# EAGLE design PGTN021_teensy (EAGLE 9.5.0)
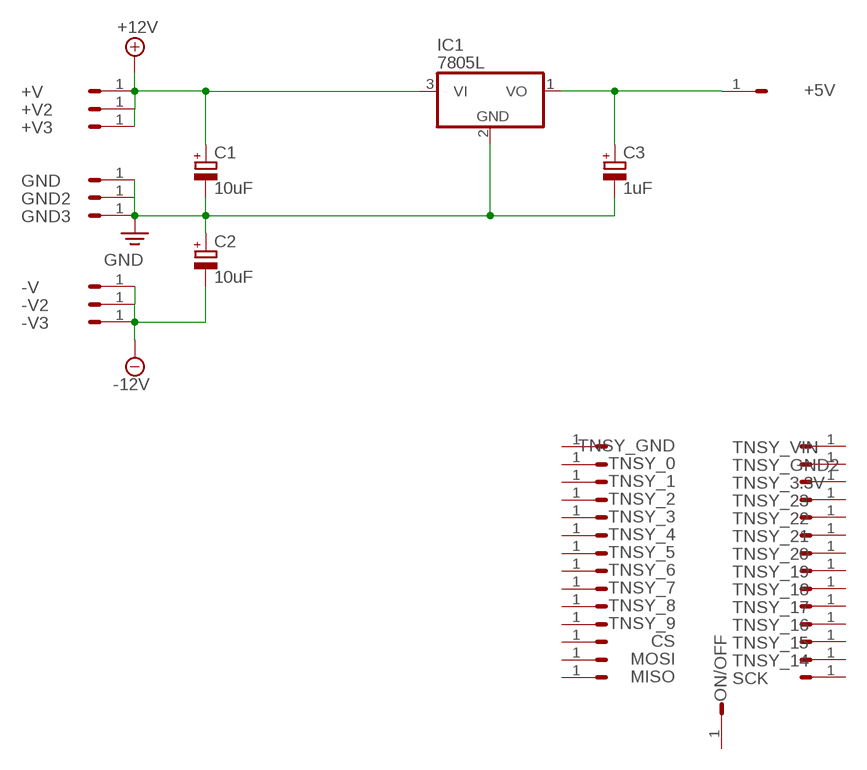
[diagram p0: schematic, sheet 1]

## Parts
+5V  HEADER/MALE/01  [HEADER/MALE/01]
+V  HEADER/MALE/01  [HEADER/MALE/01]
+V2  HEADER/MALE/01  [HEADER/MALE/01]
+V3  HEADER/MALE/01  [HEADER/MALE/01]
-V  HEADER/MALE/01  [HEADER/MALE/01]
-V2  HEADER/MALE/01  [HEADER/MALE/01]
-V3  HEADER/MALE/01  [HEADER/MALE/01]
C1  10uF  CAPACITOR/POLARIZEDE2.5-6  [E2,5-6]
C2  10uF  CAPACITOR/POLARIZEDE2.5-6  [E2,5-6]
C3  1uF  CAPACITOR/POLARIZEDE2.5-6  [E2,5-6]
CS  HEADER/MALE/01  [HEADER/MALE/01]
GND  HEADER/MALE/01  [HEADER/MALE/01]
GND2  HEADER/MALE/01  [HEADER/MALE/01]
GND3  HEADER/MALE/01  [HEADER/MALE/01]
IC1  7805L  [TO92]
MISO  HEADER/MALE/01  [HEADER/MALE/01]
MOSI  HEADER/MALE/01  [HEADER/MALE/01]
ON/OFF  HEADER/MALE/01  [HEADER/MALE/01]
SCK  HEADER/MALE/01  [HEADER/MALE/01]
TNSY_0  HEADER/MALE/01  [HEADER/MALE/01]
TNSY_1  HEADER/MALE/01  [HEADER/MALE/01]
TNSY_2  HEADER/MALE/01  [HEADER/MALE/01]
TNSY_3  HEADER/MALE/01  [HEADER/MALE/01]
TNSY_3.3V  HEADER/MALE/01  [HEADER/MALE/01]
TNSY_4  HEADER/MALE/01  [HEADER/MALE/01]
TNSY_5  HEADER/MALE/01  [HEADER/MALE/01]
TNSY_6  HEADER/MALE/01  [HEADER/MALE/01]
TNSY_7  HEADER/MALE/01  [HEADER/MALE/01]
TNSY_8  HEADER/MALE/01  [HEADER/MALE/01]
TNSY_9  HEADER/MALE/01  [HEADER/MALE/01]
TNSY_14  HEADER/MALE/01  [HEADER/MALE/01]
TNSY_15  HEADER/MALE/01  [HEADER/MALE/01]
TNSY_16  HEADER/MALE/01  [HEADER/MALE/01]
TNSY_17  HEADER/MALE/01  [HEADER/MALE/01]
TNSY_18  HEADER/MALE/01  [HEADER/MALE/01]
TNSY_19  HEADER/MALE/01  [HEADER/MALE/01]
TNSY_20  HEADER/MALE/01  [HEADER/MALE/01]
TNSY_21  HEADER/MALE/01  [HEADER/MALE/01]
TNSY_22  HEADER/MALE/01  [HEADER/MALE/01]
TNSY_23  HEADER/MALE/01  [HEADER/MALE/01]
TNSY_GND  HEADER/MALE/01  [HEADER/MALE/01]
TNSY_GND2  HEADER/MALE/01  [HEADER/MALE/01]
TNSY_VIN  HEADER/MALE/01  [HEADER/MALE/01]

## Nets
+12V: +V2.1 +V3.1 +V.1 C1.+ IC1.3(VI)
-12V: -V2.1 -V3.1 -V.1 C2.-
GND: C1.- C2.+ C3.- GND2.1 GND3.1 GND.1 IC1.2(GND)
N$1: +5V.1 C3.+ IC1.1(VO)
Unconnected: CS.1 MISO.1 MOSI.1 ON/OFF.1 SCK.1 TNSY_0.1 TNSY_1.1 TNSY_2.1 TNSY_3.1 TNSY_3.3V.1 TNSY_4.1 TNSY_5.1 TNSY_6.1 TNSY_7.1 TNSY_8.1 TNSY_9.1 TNSY_14.1 TNSY_15.1 TNSY_16.1 TNSY_17.1 TNSY_18.1 TNSY_19.1 TNSY_20.1 TNSY_21.1 TNSY_22.1 TNSY_23.1 TNSY_GND2.1 TNSY_GND.1 TNSY_VIN.1

## Library data of the parts
+5V +V +V2 +V3 -V -V2 -V3 CS GND GND2 GND3 MISO MOSI ON/OFF SCK TNSY_0 TNSY_1-TNSY_3 TNSY_3.3V TNSY_4-TNSY_9 TNSY_14-TNSY_23 TNSY_GND TNSY_GND2 TNSY_VIN = connectors:HEADER/MALE/01; SPICEPREFIX: X
C1-C3 = capacitors:CAPACITOR/POLARIZED: POLARIZED CAPACITOR, European symbol; SPICEPREFIX: C
IC1 = ic_voltage_reg:78*: Positive VOLTAGE REGULATOR Source: http://cache.national.com/ds/LM/LM78L05.pdf http://www.fairchildsemi.com/ds/LM/LM7805.pdf

## Board
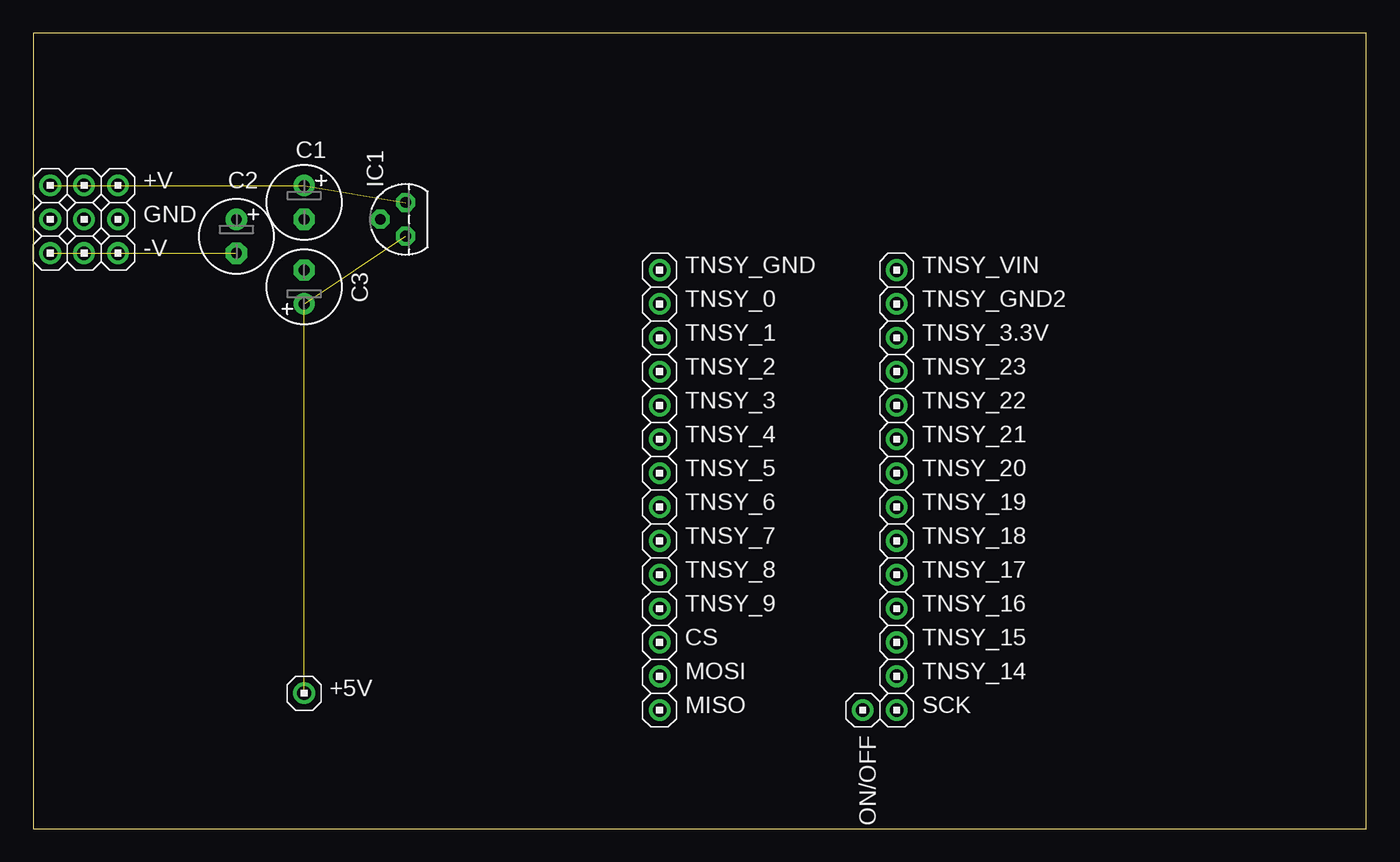
[diagram p1: board, top side]
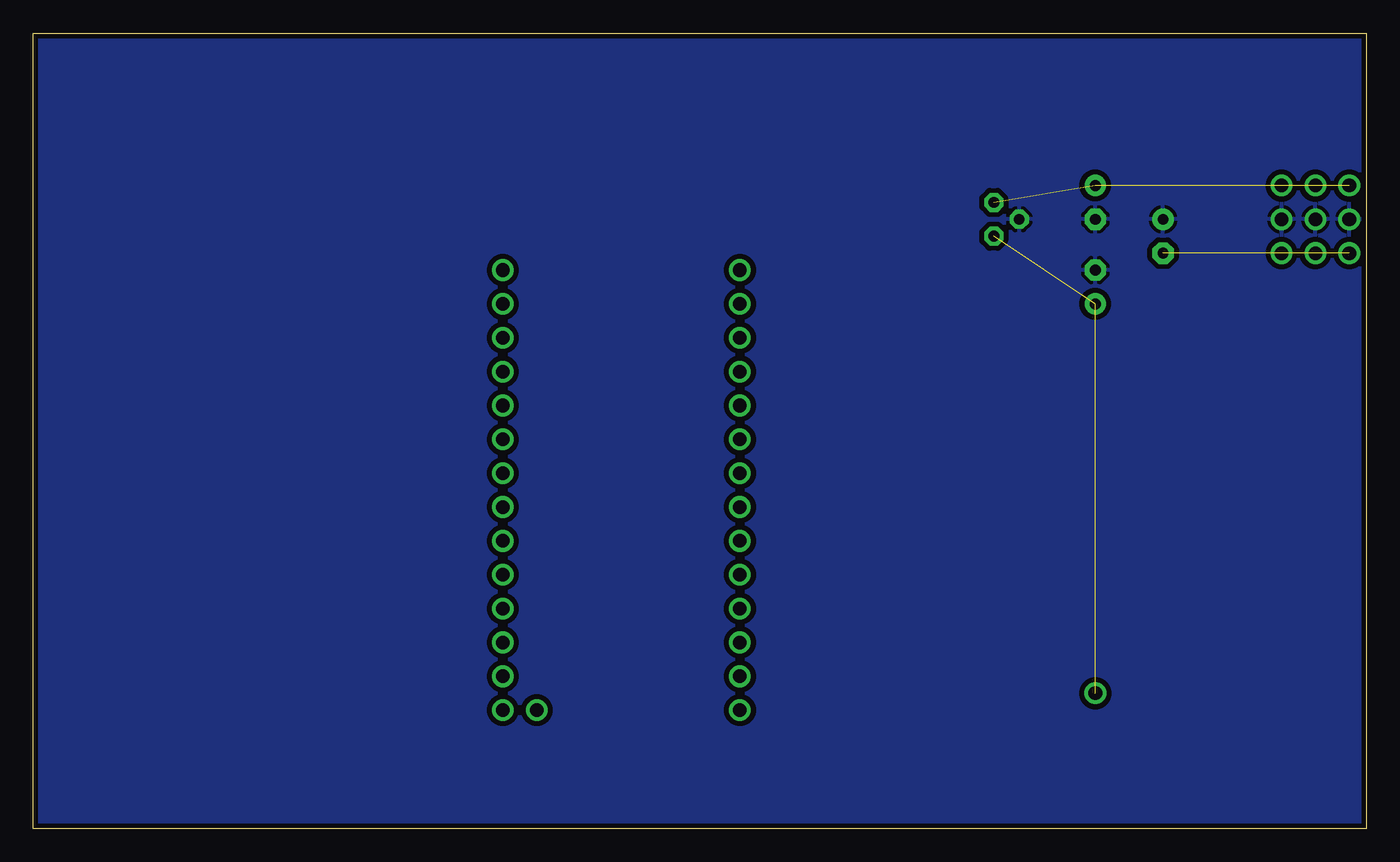
[diagram p2: board, bottom side, seen from below]

Size 100 x 59.68 mm. Coordinates in mm from the lower left corner, seen from the top.
Outline: 0,0 100,0 100,59.68 0,59.68 0,0
Copper layers (1*16): Top 0.0356mm / dielectric 1.5011mm / Bottom 0.0356mm
Design rules "pigatron": minimum track width 12mil, minimum drill 13mil, track to track 15mil, track to pad 10mil, pad to pad 10mil, via to via 10mil, smd to smd 6mil, copper to edge 15mil, drill to drill 10mil, minimum pad ring 12mil, minimum via ring 10mil, stop-mask expansion 4mil, vias tented up to drill 0mil, thermal gap 10mil

### Footprints (pad centres in the part's own frame; a part is rotated, then mirrored left to right if it is on the bottom)
HEADER/MALE/01 = drill 1.016: 1 0,0
E2,5-6 = drill 0.813 pad 1.6: + -1.27,0 | drill 0.813 pad 1.6 octagon: - 1.27,0
TO92 = drill 0.813 octagon: 1 -1.27,0; 2 0,1.905; 3 1.27,0

### Placement (x,y rotation side)
+5V  20.32,10.16 0 top
+V  6.35,48.26 0 top
+V2  3.81,48.26 0 top
+V3  1.27,48.26 0 top
-V  6.35,43.18 0 top
-V2  3.81,43.18 0 top
-V3  1.27,43.18 0 top
C1  20.32,46.99 270 top
C2  15.24,44.45 270 top
C3  20.32,40.64 90 top
CS  46.99,13.97 0 top
GND  6.35,45.72 0 top
GND2  1.27,45.72 0 top
GND3  3.81,45.72 0 top
IC1  27.94,45.72 90 top
MISO  46.99,8.89 0 top
MOSI  46.99,11.43 0 top
ON/OFF  62.23,8.89 270 top
SCK  64.77,8.89 0 top
TNSY_0  46.99,39.37 0 top
TNSY_1  46.99,36.83 0 top
TNSY_2  46.99,34.29 0 top
TNSY_3  46.99,31.75 0 top
TNSY_3.3V  64.77,36.83 0 top
TNSY_4  46.99,29.21 0 top
TNSY_5  46.99,26.67 0 top
TNSY_6  46.99,24.13 0 top
TNSY_7  46.99,21.59 0 top
TNSY_8  46.99,19.05 0 top
TNSY_9  46.99,16.51 0 top
TNSY_14  64.77,11.43 0 top
TNSY_15  64.77,13.97 0 top
TNSY_16  64.77,16.51 0 top
TNSY_17  64.77,19.05 0 top
TNSY_18  64.77,21.59 0 top
TNSY_19  64.77,24.13 0 top
TNSY_20  64.77,26.67 0 top
TNSY_21  64.77,29.21 0 top
TNSY_22  64.77,31.75 0 top
TNSY_23  64.77,34.29 0 top
TNSY_GND  46.99,41.91 0 top
TNSY_GND2  64.77,39.37 0 top
TNSY_VIN  64.77,41.91 0 top

### Tracks (layer width: path | path; a pad name or v marks a point on that pad's centre or on a via)
+12V  (4 unrouted)
-12V  (3 unrouted)
GND
  pour Bottom: 0,59.69 0,0 100.33,0 100.33,59.69
N$1  (2 unrouted)